# EAGLE design MarsLander (EAGLE 9.6.2)
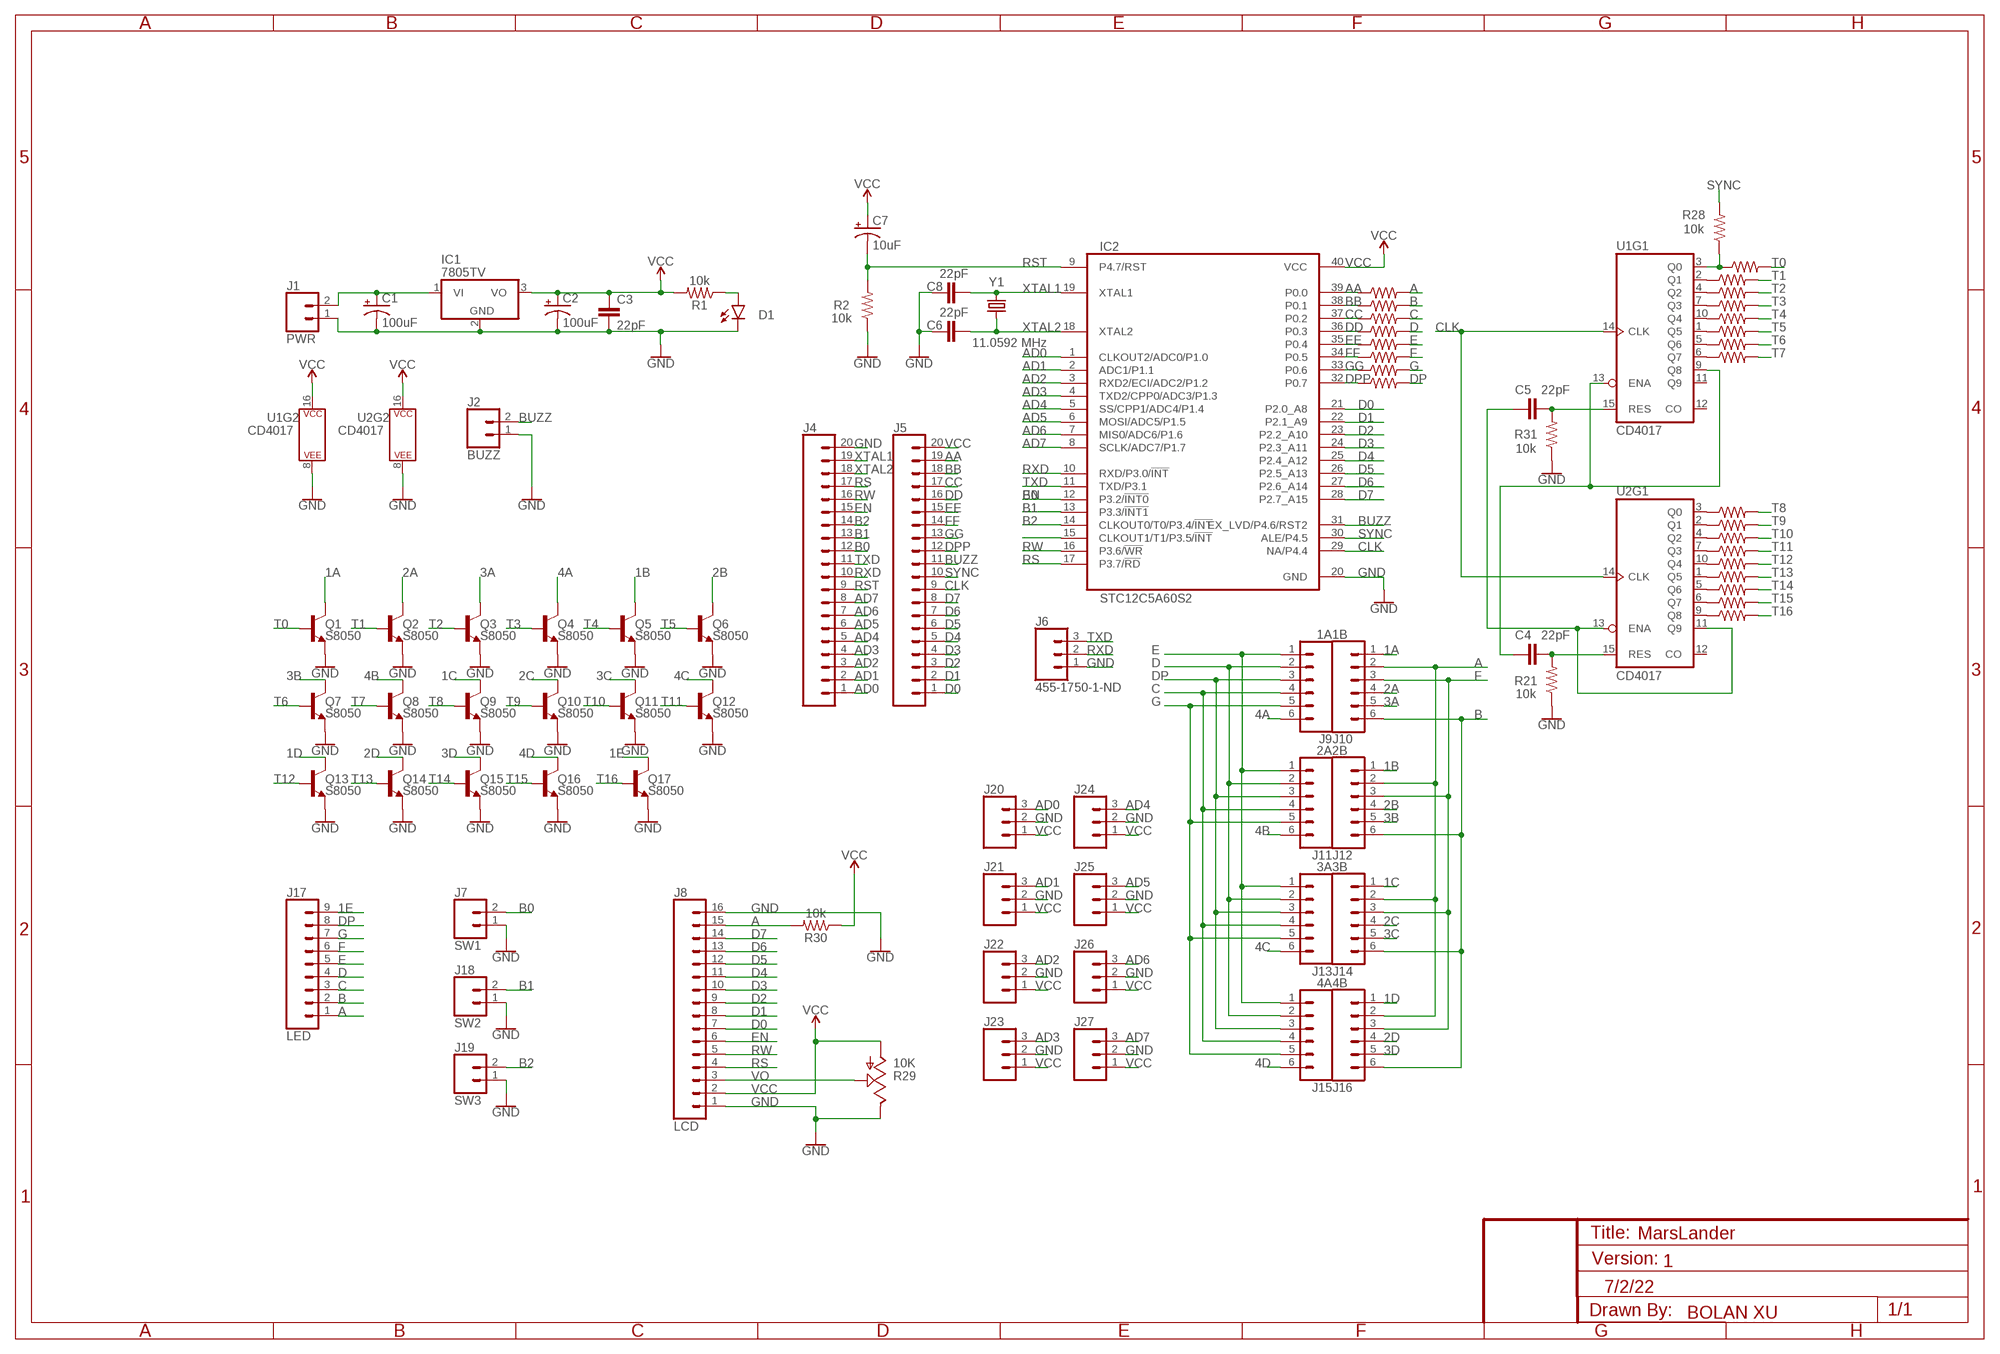
[diagram p0: schematic, sheet 1]

## Parts
C1  100uF  100UF-POLAR-RADIAL-2.5MM-25V-20%  [CPOL-RADIAL-2.5MM-6.5MM]
C2  100uF  100UF-POLAR-RADIAL-2.5MM-25V-20%  [CPOL-RADIAL-2.5MM-6.5MM]
C3  22pF  22PF-PTH-2.54MM-200V-5%  [CAP-PTH-2.54]
C4  22pF  22PF-PTH-2.54MM-200V-5%  [CAP-PTH-2.54]
C5  22pF  22PF-PTH-2.54MM-200V-5%  [CAP-PTH-2.54]
C6  22pF  22PF-PTH-2.54MM-200V-5%  [CAP-PTH-2.54]
C7  10uF  10UF-POLAR-RADIAL-2.5MM-25V-20%  [CPOL-RADIAL-2.5MM-5MM]
C8  22pF  22PF-PTH-2.54MM-200V-5%  [CAP-PTH-2.54]
D1  3MM  LED3MM  [LED_3MM]
IC1  7805TV  [TO220V]
IC2  STC12C5A60S2  STC125A60S2P  [DIL40]
J1  PWR  CONN_02  [1X02]
J2  BUZZ  CONN_02  [1X02]
J4  CONN_20  [1X20]
J5  CONN_20  [1X20]
J6  455-1750-1-ND  CONN_03  [1X03]
J7  SW1  CONN_02  [1X02]
J8  LCD  CONN_16  [1X16]
J9  1A  CONN_06SILK_FEMALE_PTH  [1X06]
J10  1B  CONN_06SILK_FEMALE_PTH  [1X06]
J11  2A  CONN_06SILK_FEMALE_PTH  [1X06]
J12  2B  CONN_06SILK_FEMALE_PTH  [1X06]
J13  3A  CONN_06SILK_FEMALE_PTH  [1X06]
J14  3B  CONN_06SILK_FEMALE_PTH  [1X06]
J15  4A  CONN_06SILK_FEMALE_PTH  [1X06]
J16  4B  CONN_06SILK_FEMALE_PTH  [1X06]
J17  LED  CONN_09  [1X09]
J18  SW2  CONN_02  [1X02]
J19  SW3  CONN_02  [1X02]
J20  455-1750-1-ND  CONN_03  [1X03]
J21  455-1750-1-ND  CONN_03  [1X03]
J22  455-1750-1-ND  CONN_03  [1X03]
J23  455-1750-1-ND  CONN_03  [1X03]
J24  455-1750-1-ND  CONN_03  [1X03]
J25  455-1750-1-ND  CONN_03  [1X03]
J26  455-1750-1-ND  CONN_03  [1X03]
J27  455-1750-1-ND  CONN_03  [1X03]
Q1  S8050  TRANS_NPN-2N3904  [TO-92]
Q2  S8050  TRANS_NPN-2N3904  [TO-92]
Q3  S8050  TRANS_NPN-2N3904  [TO-92]
Q4  S8050  TRANS_NPN-2N3904  [TO-92]
Q5  S8050  TRANS_NPN-2N3904  [TO-92]
Q6  S8050  TRANS_NPN-2N3904  [TO-92]
Q7  S8050  TRANS_NPN-2N3904  [TO-92]
Q8  S8050  TRANS_NPN-2N3904  [TO-92]
Q9  S8050  TRANS_NPN-2N3904  [TO-92]
Q10  S8050  TRANS_NPN-2N3904  [TO-92]
Q11  S8050  TRANS_NPN-2N3904  [TO-92]
Q12  S8050  TRANS_NPN-2N3904  [TO-92]
Q13  S8050  TRANS_NPN-2N3904  [TO-92]
Q14  S8050  TRANS_NPN-2N3904  [TO-92]
Q15  S8050  TRANS_NPN-2N3904  [TO-92]
Q16  S8050  TRANS_NPN-2N3904  [TO-92]
Q17  S8050  TRANS_NPN-2N3904  [TO-92]
R1  10k  10KOHM-HORIZ-1/4W-1%  [AXIAL-0.3]
R2  10k  10KOHM-HORIZ-1/4W-1%  [AXIAL-0.3]
R3  10k  10KOHM-HORIZ-1/4W-1%  [AXIAL-0.3]
R4  10k  10KOHM-HORIZ-1/4W-1%  [AXIAL-0.3]
R5  10k  10KOHM-HORIZ-1/4W-1%  [AXIAL-0.3]
R6  10k  10KOHM-HORIZ-1/4W-1%  [AXIAL-0.3]
R7  10k  10KOHM-HORIZ-1/4W-1%  [AXIAL-0.3]
R8  10k  10KOHM-HORIZ-1/4W-1%  [AXIAL-0.3]
R9  10k  10KOHM-HORIZ-1/4W-1%  [AXIAL-0.3]
R10  10k  10KOHM-HORIZ-1/4W-1%  [AXIAL-0.3]
R11  10k  10KOHM-HORIZ-1/4W-1%  [AXIAL-0.3]
R12  10k  10KOHM-HORIZ-1/4W-1%  [AXIAL-0.3]
R13  10k  10KOHM-HORIZ-1/4W-1%  [AXIAL-0.3]
R14  10k  10KOHM-HORIZ-1/4W-1%  [AXIAL-0.3]
R15  10k  10KOHM-HORIZ-1/4W-1%  [AXIAL-0.3]
R16  10k  10KOHM-HORIZ-1/4W-1%  [AXIAL-0.3]
R17  10k  10KOHM-HORIZ-1/4W-1%  [AXIAL-0.3]
R18  10k  10KOHM-HORIZ-1/4W-5%  [AXIAL-0.3]
R19  10k  10KOHM-HORIZ-1/4W-1%  [AXIAL-0.3]
R20  10k  10KOHM-HORIZ-1/4W-1%  [AXIAL-0.3]
R21  10k  10KOHM-HORIZ-1/4W-1%  [AXIAL-0.3]
R22  10k  10KOHM-HORIZ-1/4W-1%  [AXIAL-0.3]
R23  10k  10KOHM-HORIZ-1/4W-1%  [AXIAL-0.3]
R24  10k  10KOHM-HORIZ-1/4W-1%  [AXIAL-0.3]
R25  10k  10KOHM-HORIZ-1/4W-1%  [AXIAL-0.3]
R26  10k  10KOHM-HORIZ-1/4W-1%  [AXIAL-0.3]
R27  10k  10KOHM-HORIZ-1/4W-1%  [AXIAL-0.3]
R28  10k  10KOHM-HORIZ-1/4W-1%  [AXIAL-0.3]
R29  10K  TRIM_US-B25P  [B25P]
R30  10k  10KOHM-HORIZ-1/4W-1%  [AXIAL-0.3]
R31  10k  10KOHM-HORIZ-1/4W-1%  [AXIAL-0.3]
R33  10k  10KOHM-HORIZ-1/4W-1%  [AXIAL-0.3]
U1  CD4017  [DIP16]
U2  CD4017  [DIP16]
Y1  11.0592 MHz  CRYSTALPTH-HC49UV  [HC49U]

## Nets
1A: J10.1 Q1.3(C)
1B: J12.1 Q5.3(C)
1C: J14.1 Q9.3(C)
1D: J16.1 Q13.3(C)
1E: J17.9 Q17.3(C)
2A: J10.4 Q2.3(C)
2B: J12.4 Q6.3(C)
2C: J14.4 Q10.3(C)
2D: J16.4 Q14.3(C)
3A: J10.5 Q3.3(C)
3B: J12.5 Q7.3(C)
3C: J14.5 Q11.3(C)
3D: J16.5 Q15.3(C)
4A: J9.6 Q4.3(C)
4B: J11.6 Q8.3(C)
4C: J13.6 Q12.3(C)
4D: J15.6 Q16.3(C)
A: J8.15 J10.2 J12.2 J14.2 J16.2 J17.1 R19.P$2 R30.P$2
AA: IC2.39(P0.0) J5.19 R19.P$1
AD0: IC2.1(CLKOUT2/ADC0/P1.0) J4.1 J20.3
AD1: IC2.2(ADC1/P1.1) J4.2 J21.3
AD2: IC2.3(RXD2/ECI/ADC2/P1.2) J4.3 J22.3
AD3: IC2.4(TXD2/CPP0/ADC3/P1.3) J4.4 J23.3
AD4: IC2.5(SS/CPP1/ADC4/P1.4) J4.5 J24.3
AD5: IC2.6(MOSI/ADC5/P1.5) J4.6 J25.3
AD6: IC2.7(MIS0/ADC6/P1.6) J4.7 J26.3
AD7: IC2.8(SCLK/ADC7/P1.7) J4.8 J27.3
B: J10.6 J12.6 J14.6 J16.6 J17.2 R20.P$2
B0: IC2.12(P3.2/!INT0) J4.12 J7.2
B1: IC2.13(P3.3/!INT1) J4.13 J18.2
B2: IC2.14(CLKOUT0/T0/P3.4/!INT) J4.14 J19.2
BB: IC2.38(P0.1) J5.18 R20.P$1
BUZZ: IC2.31(EX_LVD/P4.6/RST2) J2.2 J5.11
C: J9.4 J11.4 J13.4 J15.4 J17.3 R22.P$2
CC: IC2.37(P0.2) J5.17 R22.P$1
CLK: IC2.29(NA/P4.4) J5.9 U1.14(CLK) U2.14(CLK)
D: J9.2 J11.2 J13.2 J15.2 J17.4 R23.P$2
D0: IC2.21(P2.0_A8) J5.1 J8.7
D1: IC2.22(P2.1_A9) J5.2 J8.8
D2: IC2.23(P2.2_A10) J5.3 J8.9
D3: IC2.24(P2.3_A11) J5.4 J8.10
D4: IC2.25(P2.4_A12) J5.5 J8.11
D5: IC2.26(P2.5_A13) J5.6 J8.12
D6: IC2.27(P2.6_A14) J5.7 J8.13
D7: IC2.28(P2.7_A15) J5.8 J8.14
DD: IC2.36(P0.3) J5.16 R23.P$1
DP: J9.3 J11.3 J13.3 J15.3 J17.8 R27.P$2
DPP: IC2.32(P0.7) J5.12 R27.P$1
E: J9.1 J11.1 J13.1 J15.1 J17.5 R24.P$2
EE: IC2.35(P0.4) J5.15 R24.P$1
EN: IC2.15(CLKOUT1/T1/P3.5/!INT) J4.15 J8.6
F: J10.3 J12.3 J14.3 J16.3 J17.6 R25.P$2
FF: IC2.34(P0.5) J5.14 R25.P$1
G: J9.5 J11.5 J13.5 J15.5 J17.7 R26.P$2
GG: IC2.33(P0.6) J5.13 R26.P$1
GND [supply]: C1.2(-) C2.2(-) C3.2 C6.1 C8.1 D1.K(C) IC1.2(GND) IC2.20(GND) J1.1 J2.1 J4.20 J6.1 J7.1 J8.1 J8.16 J18.1 J19.1 J20.2 J21.2 J22.2 J23.2 J24.2 J25.2 J26.2 J27.2 Q1.1(E) Q2.1(E) Q3.1(E) Q4.1(E) Q5.1(E) Q6.1(E) Q7.1(E) Q8.1(E) Q9.1(E) Q10.1(E) Q11.1(E) Q12.1(E) Q13.1(E) Q14.1(E) Q15.1(E) Q16.1(E) Q17.1(E) R2.P$1 R21.P$1 R29.E R31.P$1 U1.8(P$V-) U2.8(P$V-)
N$2: C1.1(+) IC1.1(VI) J1.2
N$3: C4.1 U1.9(Q8) U1.13(ENA)
N$4: C5.1 U2.11(Q9) U2.13(ENA)
N$5: C5.2 R31.P$2 U1.15(RES)
N$6: C4.2 R21.P$2 U2.15(RES)
N$12: R28.P$1 R33.P$1 U1.3(Q0)
N$13: R3.P$1 U1.2(Q1)
N$14: R4.P$1 U1.4(Q2)
N$15: R5.P$1 U1.7(Q3)
N$16: R6.P$1 U1.10(Q4)
N$17: R7.P$1 U1.1(Q5)
N$18: R8.P$1 U1.5(Q6)
N$19: R9.P$1 U1.6(Q7)
N$20: R10.P$1 U2.3(Q0)
N$21: R11.P$1 U2.2(Q1)
N$22: R12.P$1 U2.4(Q2)
N$23: D1.A R1.P$1
N$24: R13.P$1 U2.7(Q3)
N$25: R14.P$1 U2.10(Q4)
N$26: R15.P$1 U2.1(Q5)
N$27: R16.P$1 U2.5(Q6)
N$28: R17.P$1 U2.6(Q7)
N$29: R18.P$1 U2.9(Q8)
RS: IC2.17(P3.7/!RD) J4.17 J8.4
RST: C7.2(-) IC2.9(P4.7/RST) J4.9 R2.P$2
RW: IC2.16(P3.6/!WR) J4.16 J8.5
RXD: IC2.10(RXD/P3.0/!INT) J4.10 J6.2
SYNC: IC2.30(ALE/P4.5) J5.10 R28.P$2
T0: Q1.2(B) R33.P$2
T1: Q2.2(B) R3.P$2
T2: Q3.2(B) R4.P$2
T3: Q4.2(B) R5.P$2
T4: Q5.2(B) R6.P$2
T5: Q6.2(B) R7.P$2
T6: Q7.2(B) R8.P$2
T7: Q8.2(B) R9.P$2
T8: Q9.2(B) R10.P$2
T9: Q10.2(B) R11.P$2
T10: Q11.2(B) R12.P$2
T11: Q12.2(B) R13.P$2
T12: Q13.2(B) R14.P$2
T13: Q14.2(B) R15.P$2
T14: Q15.2(B) R16.P$2
T15: Q16.2(B) R17.P$2
T16: Q17.2(B) R18.P$2
TXD: IC2.11(TXD/P3.1) J4.11 J6.3
VCC [supply]: C2.1(+) C3.1 C7.1(+) IC1.3(VO) IC2.40(VCC) J5.20 J8.2 J20.1 J21.1 J22.1 J23.1 J24.1 J25.1 J26.1 J27.1 R1.P$2 R29.A R30.P$1 U1.16(P$V+) U2.16(P$V+)
VO: J8.3 R29.S
XTAL1: C8.2 IC2.19(XTAL1) J4.19 Y1.2
XTAL2: C6.2 IC2.18(XTAL2) J4.18 Y1.1
Unconnected: U1.11(Q9) U1.12(CO) U2.12(CO)

## Notes on the sheet
- 1
- 7/2/22
- BOLAN XU

## Library data of the parts
C1 C2 = SparkFun-Capacitors:100UF-POLAR: 100µF polarized capacitors A capacitor is a passive two-terminal electrical component used to store electrical energy temporarily in an electric field.; PROD_ID: CAP-08439
C3-C6 C8 = SparkFun-Capacitors:22PF: 22pF ceramic capacitors A capacitor is a passive two-terminal electrical component used to store electrical energy temporarily in an electric field.; PROD_ID: CAP-09128
C7 = SparkFun-Capacitors:10UF-POLAR: 10.0µF polarized capacitors A capacitor is a passive two-terminal electrical component used to store electrical energy temporarily in an electric field.; PROD_ID: CAP-08440
D1 = SparkFun-LED:LED: LED (Generic) Standard schematic elements and footprints for 5mm, 3mm, 1206, and 0603 sized LEDs. Generic LEDs with no color specified.; PROD_ID: DIO-08794
IC1 = linear:78*: Positive VOLTAGE REGULATOR Source: http://cache.national.com/ds/LM/LM78L05.pdf http://www.fairchildsemi.com/ds/LM/LM7805.pdf
IC2 = stc-microcontrollers:STC125A60S2: 8-bit Microcontroller with 4K BytesIn-System Programmable Flash Source: http://www.atmel.com/dyn/resources/prod_documents/doc2487.pdf
J1 J2 J7 J18 J19 = SparkFun-Connectors:CONN_02: Multi connection point. Often used as Generic Header-pin footprint for 0.1 inch spaced/style header connections On any of the 0.1 inch spaced packages, you can populate with these: Break Away Headers - Straight <https://www.sparkfun.com/products/116> (PRT-00116) Break Away Male Headers - Right Angle <https://www.sparkfun.com/products/553> (PRT-00553) Female Headers <https://www.sparkfun.com/products/115> (PRT-00115) Break Away Headers - Machine Pin <https://www.sparkfun.com/products/117> (PRT-00117) Break Away Female Headers - Swiss Machine Pin <https://www.sparkfun.com/products/743> (PRT-00743) For SCREWTERMINALS and SPRING TERMINALS visit here: Screw Terimnals on SparkFun.com <https://www.sparkfun.com/search/results?term=Screw+Terminals> (5mm/3.5mm/2.54mm spacing) This device is also useful as a general connection point to wire up your design to another part of your project. Our various solder wires solder well into these plated through hole pads. Hook-Up Wire - Assortment (Stranded, 22 AWG) <https://www.sparkfun.com/products/11375> (PRT-11375) Hook-Up Wire - Assortment (Solid Core, 22 AWG) <https://www.sparkfun.com/products/11367> (PRT-11367) View the entire wire category on our website here <https://www.sparkfun.com/categories/141> Special notes: Molex polarized connector foot print use with: PRT-08233 with associated crimp pins and housings. 2.54_SCREWTERM for use with PRT-10571. 3.5mm Screw Terminal footprints for PRT-08084 5mm Screw Terminal footprints for use with PRT-08432
J4 J5 = SparkFun-Connectors:CONN_20: Multi connection point. Often used as Generic Header-pin footprint for 0.1 inch spaced/style header connections On any of the 0.1 inch spaced packages, you can populate with these: Break Away Headers - Straight <https://www.sparkfun.com/products/116> (PRT-00116) Break Away Male Headers - Right Angle <https://www.sparkfun.com/products/553> (PRT-00553) Female Headers <https://www.sparkfun.com/products/115> (PRT-00115) Break Away Headers - Machine Pin <https://www.sparkfun.com/products/117> (PRT-00117) Break Away Female Headers - Swiss Machine Pin <https://www.sparkfun.com/products/743> (PRT-00743) For SCREWTERMINALS and SPRING TERMINALS visit here: Screw Terimnals on SparkFun.com <https://www.sparkfun.com/search/results?term=Screw+Terminals> (5mm/3.5mm/2.54mm spacing) This device is also useful as a general connection point to wire up your design to another part of your project. Our various solder wires solder well into these plated through hole pads. Hook-Up Wire - Assortment (Stranded, 22 AWG) <https://www.sparkfun.com/products/11375> (PRT-11375) Hook-Up Wire - Assortment (Solid Core, 22 AWG) <https://www.sparkfun.com/products/11367> (PRT-11367) View the entire wire category on our website here <https://www.sparkfun.com/categories/141> Special notes: Molex polarized connector foot print use with SKU : PRT-08231 with associated crimp pins and housings. 1MM SMD Version SKU: PRT-10208 NOTES ON THE VARIANTS LOCK and LOCK_LONGPADS... This footprint was designed to help hold the alignment of a through-hole component (i.e. 6-pin header) while soldering it into place. You may notice that each hole has been shifted either up or down by 0.005 of an inch from it's more standard position (which is a perfectly straight line). This slight alteration caused the pins (the squares in the middle) to touch the edges of the holes. Because they are alternating, it causes a "brace" to hold the component in place. 0.005 has proven to be the perfect amount of "off-center" position when using our standard breakaway headers. Although looks a little odd when you look at the bare footprint, once you have a header in there, the alteration is very hard to notice. Also,if you push a header all the way into place, it is covered up entirely on the bottom side. Note about LOCK SPECIAL package: This is just like the LOCK variant in that the holes are staggared by 5 mil, but except for the last two holes. They are not altered from the "standard" footprint layout. This is used for a special purpose on the layout of our Graphic LCD Backpack. Make sure you want to use this device before selecting it for you project!
J6 J20-J27 = SparkFun-Connectors:CONN_03: Multi connection point. Often used as Generic Header-pin footprint for 0.1 inch spaced/style header connections On any of the 0.1 inch spaced packages, you can populate with these: Break Away Headers - Straight <https://www.sparkfun.com/products/116> (PRT-00116) Break Away Male Headers - Right Angle <https://www.sparkfun.com/products/553> (PRT-00553) Female Headers <https://www.sparkfun.com/products/115> (PRT-00115) Break Away Headers - Machine Pin <https://www.sparkfun.com/products/117> (PRT-00117) Break Away Female Headers - Swiss Machine Pin <https://www.sparkfun.com/products/743> (PRT-00743) Stackable Header - 3 Pin (Female, 0.1") <https://www.sparkfun.com/products/13875> (PRT-13875) For SCREWTERMINALS and SPRING TERMINALS visit here: Screw Terimnals on SparkFun.com <https://www.sparkfun.com/search/results?term=Screw+Terminals> (5mm/3.5mm/2.54mm spacing) This device is also useful as a general connection point to wire up your design to another part of your project. Our various solder wires solder well into these plated through hole pads. Hook-Up Wire - Assortment (Stranded, 22 AWG) <https://www.sparkfun.com/products/11375> (PRT-11375) Hook-Up Wire - Assortment (Solid Core, 22 AWG) <https://www.sparkfun.com/products/11367> (PRT-11367) View the entire wire category on our website here <https://www.sparkfun.com/categories/141> Special notes: Molex polarized connector foot print use with SKU : PRT-08232 with associated crimp pins and housings.; PROD_ID: XXX-00000
J8 = SparkFun-Connectors:CONN_16: Multi connection point. Often used as Generic Header-pin footprint for 0.1 inch spaced/style header connections On any of the 0.1 inch spaced packages, you can populate with these: Break Away Headers - Straight <https://www.sparkfun.com/products/116> (PRT-00116) Break Away Male Headers - Right Angle <https://www.sparkfun.com/products/553> (PRT-00553) Female Headers <https://www.sparkfun.com/products/115> (PRT-00115) Break Away Headers - Machine Pin <https://www.sparkfun.com/products/117> (PRT-00117) Break Away Female Headers - Swiss Machine Pin <https://www.sparkfun.com/products/743> (PRT-00743) For SCREWTERMINALS and SPRING TERMINALS visit here: Screw Terimnals on SparkFun.com <https://www.sparkfun.com/search/results?term=Screw+Terminals> (5mm/3.5mm/2.54mm spacing) This device is also useful as a general connection point to wire up your design to another part of your project. Our various solder wires solder well into these plated through hole pads. Hook-Up Wire - Assortment (Stranded, 22 AWG) <https://www.sparkfun.com/products/11375> (PRT-11375) Hook-Up Wire - Assortment (Solid Core, 22 AWG) <https://www.sparkfun.com/products/11367> (PRT-11367) View the entire wire category on our website here <https://www.sparkfun.com/categories/141> Special notes: Molex polarized connector foot print use with SKU : PRT-08231 with associated crimp pins and housings. 1MM SMD Version SKU: PRT-10208 NOTES ON THE VARIANTS LOCK and LOCK_LONGPADS... This footprint was designed to help hold the alignment of a through-hole component (i.e. 6-pin header) while soldering it into place. You may notice that each hole has been shifted either up or down by 0.005 of an inch from it's more standard position (which is a perfectly straight line). This slight alteration caused the pins (the squares in the middle) to touch the edges of the holes. Because they are alternating, it causes a "brace" to hold the component in place. 0.005 has proven to be the perfect amount of "off-center" position when using our standard breakaway headers. Although looks a little odd when you look at the bare footprint, once you have a header in there, the alteration is very hard to notice. Also,if you push a header all the way into place, it is covered up entirely on the bottom side.
J9-J16 = SparkFun-Connectors:CONN_06: Multi connection point. Often used as Generic Header-pin footprint for 0.1 inch spaced/style header connections On any of the 0.1 inch spaced packages, you can populate with these: Break Away Headers - Straight <https://www.sparkfun.com/products/116> (PRT-00116) Break Away Male Headers - Right Angle <https://www.sparkfun.com/products/553> (PRT-00553) Female Headers <https://www.sparkfun.com/products/115> (PRT-00115) Break Away Headers - Machine Pin <https://www.sparkfun.com/products/117> (PRT-00117) Break Away Female Headers - Swiss Machine Pin <https://www.sparkfun.com/products/743> (PRT-00743) Arduino Stackable Header - 6 Pin <https://www.sparkfun.com/products/9280> (PRT-09280) Screw Terminals 2.54mm Pitch (6-Pin) <https://www.sparkfun.com/products/16499> (PRT-16499) For SCREWTERMINALS and SPRING TERMINALS visit here: Screw Terimnals on SparkFun.com <https://www.sparkfun.com/search/results?term=Screw+Terminals> (5mm/3.5mm/2.54mm spacing) This device is also useful as a general connection point to wire up your design to another part of your project. Our various solder wires solder well into these plated through hole pads. Hook-Up Wire - Assortment (Stranded, 22 AWG) <https://www.sparkfun.com/products/11375> (PRT-11375) Hook-Up Wire - Assortment (Solid Core, 22 AWG) <https://www.sparkfun.com/products/11367> (PRT-11367) View the entire wire category on our website here <https://www.sparkfun.com/categories/141>; PROD_ID: CONN-08437
J17 = SparkFun-Connectors:CONN_09: Multi connection point. Often used as Generic Header-pin footprint for 0.1 inch spaced/style header connections On any of the 0.1 inch spaced packages, you can populate with these: Break Away Headers - Straight <https://www.sparkfun.com/products/116> (PRT-00116) Break Away Male Headers - Right Angle <https://www.sparkfun.com/products/553> (PRT-00553) Female Headers <https://www.sparkfun.com/products/115> (PRT-00115) Break Away Headers - Machine Pin <https://www.sparkfun.com/products/117> (PRT-00117) Break Away Female Headers - Swiss Machine Pin <https://www.sparkfun.com/products/743> (PRT-00743) For SCREWTERMINALS and SPRING TERMINALS visit here: Screw Terimnals on SparkFun.com <https://www.sparkfun.com/search/results?term=Screw+Terminals> (5mm/3.5mm/2.54mm spacing) This device is also useful as a general connection point to wire up your design to another part of your project. Our various solder wires solder well into these plated through hole pads. Hook-Up Wire - Assortment (Stranded, 22 AWG) <https://www.sparkfun.com/products/11375> (PRT-11375) Hook-Up Wire - Assortment (Solid Core, 22 AWG) <https://www.sparkfun.com/products/11367> (PRT-11367) View the entire wire category on our website here <https://www.sparkfun.com/categories/141> Special notes: Molex polarized connector foot print use with SKU : PRT-08231 with associated crimp pins and housings. 1MM SMD Version SKU: PRT-10208 NOTES ON THE VARIANTS LOCK and LOCK_LONGPADS... This footprint was designed to help hold the alignment of a through-hole component (i.e. 6-pin header) while soldering it into place. You may notice that each hole has been shifted either up or down by 0.005 of an inch from it's more standard position (which is a perfectly straight line). This slight alteration caused the pins (the squares in the middle) to touch the edges of the holes. Because they are alternating, it causes a "brace" to hold the component in place. 0.005 has proven to be the perfect amount of "off-center" position when using our standard breakaway headers. Although looks a little odd when you look at the bare footprint, once you have a header in there, the alteration is very hard to notice. Also,if you push a header all the way into place, it is covered up entirely on the bottom side.
Q1-Q17 = SparkFun-DiscreteSemi:TRANS_NPN: NPN transistor Current controlled devices typically used to amplify current or used as a switch. BC547 - COM-08928 <http://www.sparkfun.com/products/8928> (TO-92 45V 100mA) (1.Collector 2.Base 3.Emitter) 2N3904 - COM-00521 <http://www.sparkfun.com/products/521> (TO-92 40V 200mA) (1.Emitter 2.Base 3.Collector) P2N2222A - COM-12852 <http://www.sparkfun.com/products/12852> (TO-92 40V 600mA) (1.Collector 2.Base 3.Emitter); PROD_ID: TRANS-08447; VALUE: 200mA/40V
R1-R17 R19-R28 R30 R31 R33 = SparkFun-Resistors:10KOHM: 10kΩ resistor A resistor is a passive two-terminal electrical component that implements electrical resistance as a circuit element. Resistors act to reduce current flow, and, at the same time, act to lower voltage levels within circuits. - Wikipedia; PROD_ID: RES-12183
R18 = SparkFun-Resistors:10KOHM: 10kΩ resistor A resistor is a passive two-terminal electrical component that implements electrical resistance as a circuit element. Resistors act to reduce current flow, and, at the same time, act to lower voltage levels within circuits. - Wikipedia; PROD_ID: RES-09435
R29 = pot:TRIM_US-: POTENTIOMETER
U1 U2 = SparkFun-IC-Logic:CD4017: 10-Out Decade Counter Datasheet <https://cdn.sparkfun.com/datasheets/Kits/cd4022b.pdf> SparkFun Products SparkFun SparkPunk Sequencer Kit <https://www.sparkfun.com/products/12707> (KIT-12707); PROD_ID: IC-11929
Y1 = SparkFun-Clocks:CRYSTAL: Crystals (Generic) These are passive quartz crystals, which can be used as a clock source for a microcontroller. Crystal's are two-terminal devices. They require external "load" capacitors to generate an oscillating signal.

## Net classes
1 supply: width 0.508 mm

## Board
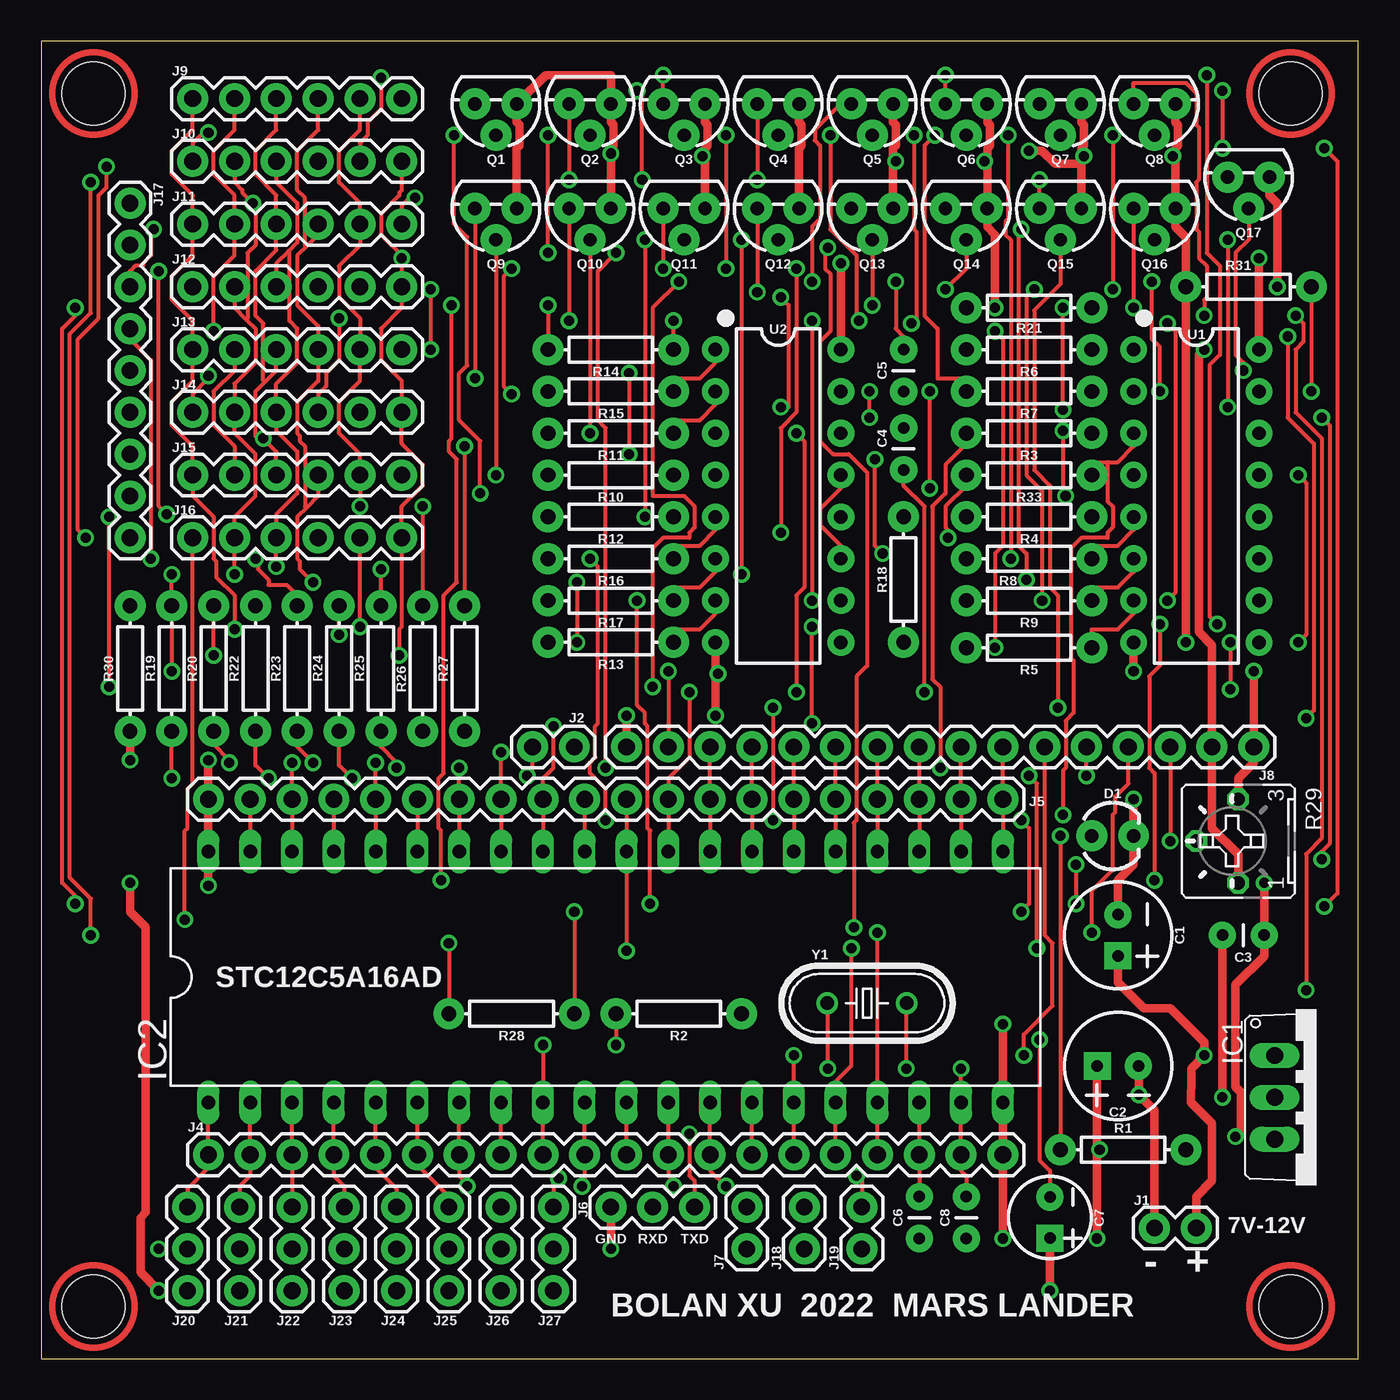
[diagram p1: board, top side]
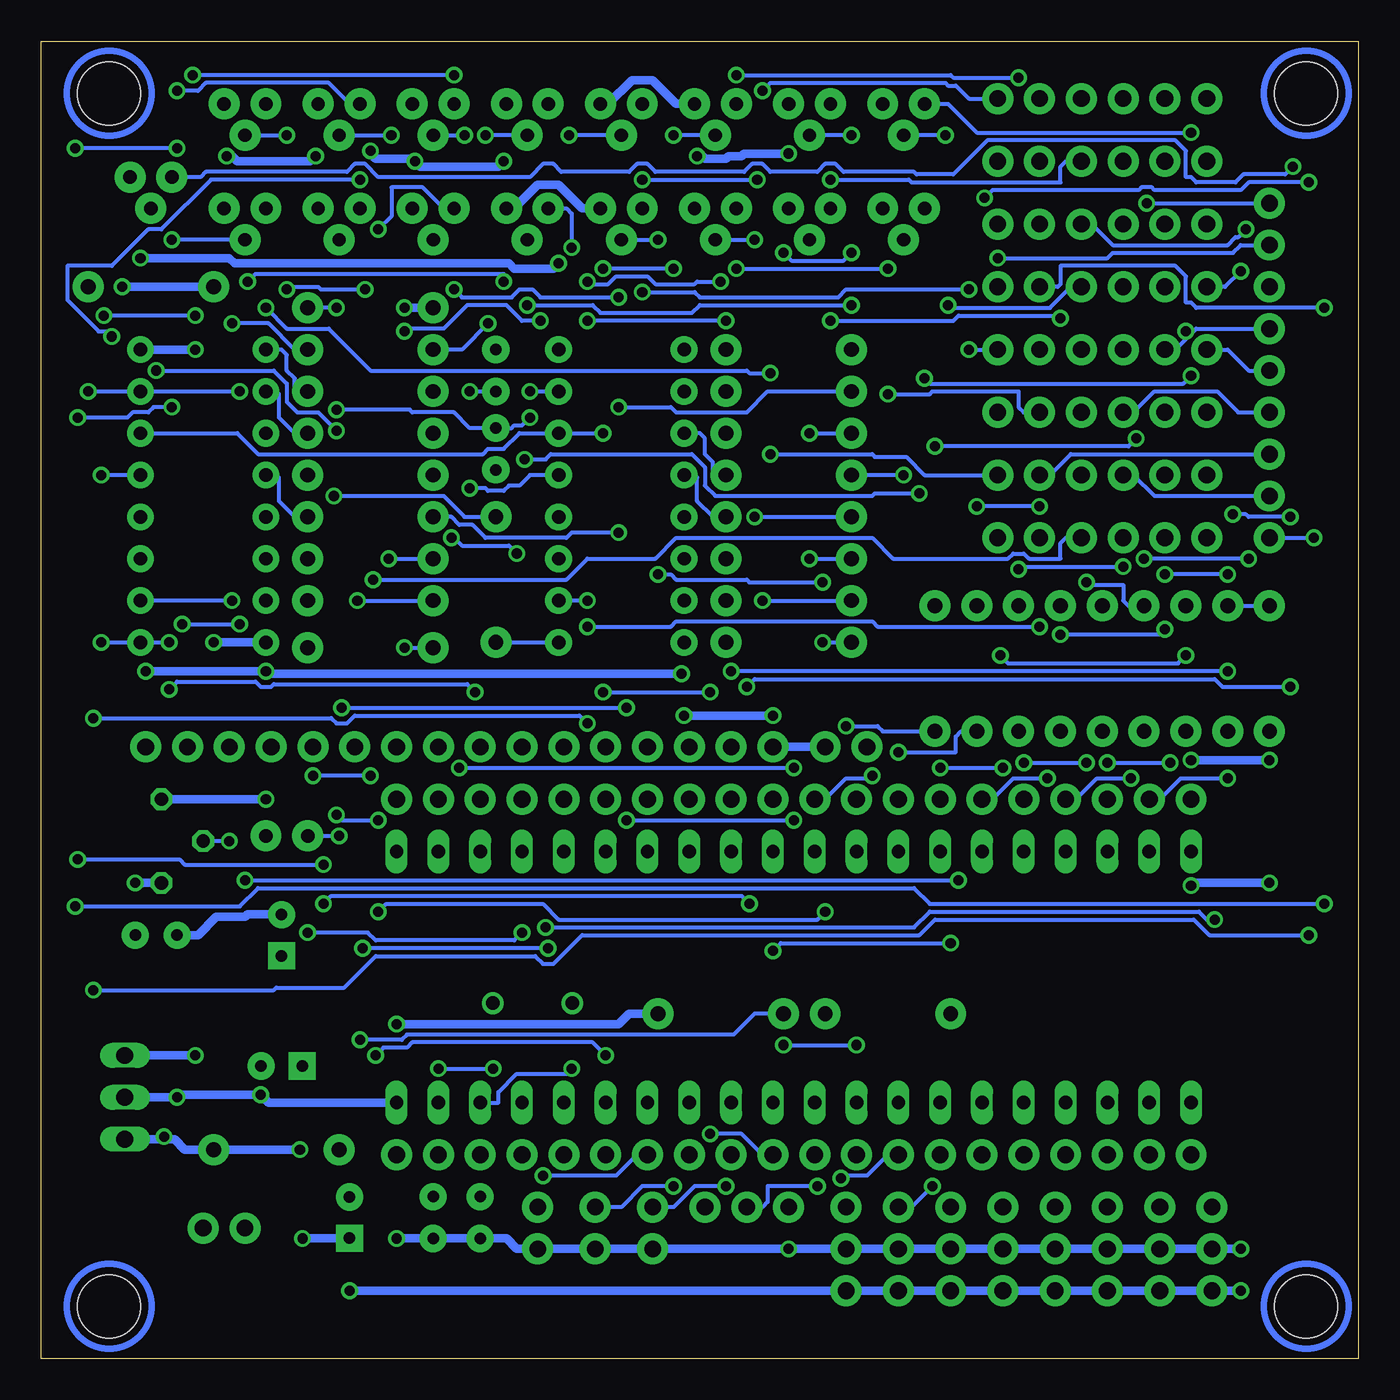
[diagram p2: board, bottom side, seen from below]

Size 80.01 x 80 mm. Coordinates in mm from the lower left corner, seen from the top.
Outline: 0,80 0,0 80.01,0.01 80.01,80 0,80
Copper layers (1*16): Top 0.035mm / dielectric 1.5mm / Bottom 0.035mm
Design rules "default": minimum track width 10mil, minimum drill 24mil, track to track 8mil, track to pad 8mil, pad to pad 8mil, via to via 8mil, smd to smd 8mil, copper to edge 40mil, drill to drill 8mil, minimum pad ring 10mil, minimum via ring 8mil, stop-mask expansion 4mil, vias tented up to drill 0mil, thermal gap 10mil
Holes 3.81 mm at 3.17,76.83 3.17,3.17 75.88,76.83 75.88,3.17

### Footprints (pad centres in the part's own frame; a part is rotated, then mirrored left to right if it is on the bottom)
CPOL-RADIAL-2.5MM-6.5MM = drill 0.7 pad 1.651 square: 1 1.25,0 | drill 0.7 pad 1.651: 2 -1.25,0
CAP-PTH-2.54 = drill 0.7 pad 1.651: 1 -1.27,0; 2 1.27,0
CPOL-RADIAL-2.5MM-5MM = drill 0.7 pad 1.651 square: 1 1.25,0 | drill 0.7 pad 1.651: 2 -1.25,0
LED_3MM = drill 0.813 pad 1.88: A -1.27,0; K 1.27,0
TO220V = drill 1.016 long: 1 -2.54,-2.54; 2 0,-2.54; 3 2.54,-2.54
DIL40 = drill 0.813 long: 1 -24.13,-7.62; 2 -21.59,-7.62; 3 -19.05,-7.62; 4 -16.51,-7.62; 5 -13.97,-7.62; 6 -11.43,-7.62; 7 -8.89,-7.62; 8 -6.35,-7.62; 9 -3.81,-7.62; 10 -1.27,-7.62; 11 1.27,-7.62; 12 3.81,-7.62; 13 6.35,-7.62; 14 8.89,-7.62; 15 11.43,-7.62; 16 13.97,-7.62; 17 16.51,-7.62; 18 19.05,-7.62; 19 21.59,-7.62; 20 24.13,-7.62; 21 24.13,7.62; 22 21.59,7.62; 23 19.05,7.62; 24 16.51,7.62; 25 13.97,7.62; 26 11.43,7.62; 27 8.89,7.62; 28 6.35,7.62; 29 3.81,7.62; 30 1.27,7.62; 31 -1.27,7.62; 32 -3.81,7.62; 33 -6.35,7.62; 34 -8.89,7.62; 35 -11.43,7.62; 36 -13.97,7.62; 37 -16.51,7.62; 38 -19.05,7.62; 39 -21.59,7.62; 40 -24.13,7.62
1X02 = drill 1.016 pad 1.88: 1 0,0; 2 2.54,0
1X20 = drill 1.016 pad 1.88: 1 0,0; 2 2.54,0; 3 5.08,0; 4 7.62,0; 5 10.16,0; 6 12.7,0; 7 15.24,0; 8 17.78,0; 9 20.32,0; 10 22.86,0; 11 25.4,0; 12 27.94,0; 13 30.48,0; 14 33.02,0; 15 35.56,0; 16 38.1,0; 17 40.64,0; 18 43.18,0; 19 45.72,0; 20 48.26,0
1X03 = drill 1.016 pad 1.88: 1 0,0; 2 2.54,0; 3 5.08,0
1X16 = drill 1.016 pad 1.88: 1 0,0; 2 2.54,0; 3 5.08,0; 4 7.62,0; 5 10.16,0; 6 12.7,0; 7 15.24,0; 8 17.78,0; 9 20.32,0; 10 22.86,0; 11 25.4,0; 12 27.94,0; 13 30.48,0; 14 33.02,0; 15 35.56,0; 16 38.1,0
1X06 = drill 1.016 pad 1.88: 1 0,0; 2 2.54,0; 3 5.08,0; 4 7.62,0; 5 10.16,0; 6 12.7,0
1X09 = drill 1.016 pad 1.88: 1 0,0; 2 2.54,0; 3 5.08,0; 4 7.62,0; 5 10.16,0; 6 12.7,0; 7 15.24,0; 8 17.78,0; 9 20.32,0
TO-92 = drill 0.813 pad 1.88: 1 -1.27,0; 2 0,1.905; 3 1.27,0
AXIAL-0.3 = drill 0.9 pad 1.88: P$1 -3.81,0; P$2 3.81,0
B25P = drill 0.813 octagon: A -2.54,0; E 2.54,0; S 0,2.54
DIP16 = drill 0.813 pad 1.626: 1 -8.89,-3.81; 2 -6.35,-3.81; 3 -3.81,-3.81; 4 -1.27,-3.81; 5 1.27,-3.81; 6 3.81,-3.81; 7 6.35,-3.81; 8 8.89,-3.81; 9 8.89,3.81; 10 6.35,3.81; 11 3.81,3.81; 12 1.27,3.81; 13 -1.27,3.81; 14 -3.81,3.81; 15 -6.35,3.81; 16 -8.89,3.81
HC49U = drill 0.813: 1 -2.413,0; 2 2.413,0

### Placement (x,y rotation side)
C1  65.41,25.72 270 top
C2  65.41,17.78 180 top
C3  73.03,25.72 180 top
C4  52.39,55.24 90 top
C5  52.39,60.01 90 top
C6  53.34,8.57 90 top
C7  61.28,8.57 270 top
C8  56.2,8.57 90 top
D1  65.09,31.75 0 top
IC1  77.47,15.88 270 top
IC2  34.29,23.18 0 top
J1  67.63,7.94 0 top
J2  32.38,37.15 180 top
J4  10.16,12.38 0 top
J5  58.42,33.97 180 top
J6  34.61,9.21 0 top
J7  42.86,6.67 90 top
J8  73.66,37.15 180 top
J9  9.21,76.52 0 top
J10  9.21,72.71 0 top
J11  9.21,68.9 0 top
J12  9.21,65.09 0 top
J13  9.21,61.28 0 top
J14  9.21,57.47 0 top
J15  9.21,53.66 0 top
J16  9.21,49.85 0 top
J17  5.4,70.17 270 top
J18  46.35,6.67 90 top
J19  49.85,6.67 90 top
J20  8.89,4.13 90 top
J21  12.06,4.13 90 top
J22  15.24,4.13 90 top
J23  18.41,4.13 90 top
J24  21.59,4.13 90 top
J25  24.77,4.13 90 top
J26  27.94,4.13 90 top
J27  31.11,4.13 90 top
Q1  27.62,76.2 180 top
Q2  33.34,76.2 180 top
Q3  39.05,76.2 180 top
Q4  44.77,76.2 180 top
Q5  50.48,76.2 180 top
Q6  56.2,76.2 180 top
Q7  61.91,76.2 180 top
Q8  67.63,76.2 180 top
Q9  27.62,69.85 180 top
Q10  33.34,69.85 180 top
Q11  39.05,69.85 180 top
Q12  44.77,69.85 180 top
Q13  50.48,69.85 180 top
Q14  56.2,69.85 180 top
Q15  61.91,69.85 180 top
Q16  67.63,69.85 180 top
Q17  73.34,71.75 180 top
R1  65.72,12.7 0 top
R2  38.73,20.95 180 top
R3  60.01,56.2 180 top
R4  60.01,51.12 180 top
R5  60.01,43.18 180 top
R6  60.01,61.28 180 top
R7  60.01,58.74 180 top
R8  60.01,48.58 180 top
R9  60.01,46.04 180 top
R10  34.61,53.66 180 top
R11  34.61,56.2 180 top
R12  34.61,51.12 180 top
R13  34.61,43.5 180 top
R14  34.61,61.28 180 top
R15  34.61,58.74 180 top
R16  34.61,48.58 180 top
R17  34.61,46.04 180 top
R18  52.39,47.31 90 top
R19  7.94,41.91 90 top
R20  10.48,41.91 90 top
R21  60.01,63.82 0 top
R22  13.02,41.91 90 top
R23  15.56,41.91 90 top
R24  18.1,41.91 90 top
R25  20.64,41.91 90 top
R26  23.18,41.91 90 top
R27  25.72,41.91 90 top
R28  28.57,20.95 180 top
R29  72.71,31.43 90 top
R30  5.4,41.91 90 top
R31  73.34,65.09 0 top
R33  60.01,53.66 180 top
U1  70.17,52.39 270 top
U2  44.77,52.39 270 top
Y1  50.16,21.59 0 top

### Tracks (layer width: path | path; a pad name or v marks a point on that pad's centre or on a via)
1A  (via drill 0.61)
  Top 0.254: J10.1 9.21,73.82 9.84,74.45 v10.16,74.45
  Bottom 0.254: v10.16,74.45 23.18,74.45 24.92,76.2 Q1.3
1B  (via drill 0.61)
  Top 0.254: v7.14,66.04 7.14,51.75 v7.62,51.28 | v4.13,40.8 v4.13,51.12 | v37.15,40.8 37.15,49.21 37.78,49.85 39.37,49.85 39.37,50.16 39.69,50.48 39.69,51.75 39.05,52.39 37.15,52.39 37.15,63.82 v38.73,65.41 | v46.83,65.41 46.83,68.74 47.31,69.22 47.31,73.66 46.99,73.98 46.99,74.61 48.42,76.04 49.21,76.04 Q5.3
  Bottom 0.254: J12.1 8.1,65.09 v7.14,66.04 | v7.62,51.28 6.83,51.28 6.67,51.12 v4.13,51.12 | v4.13,40.8 8.26,40.8 8.73,41.27 36.67,41.27 v37.15,40.8 | v38.73,65.41 40.16,65.41 40.32,65.25 42.7,65.25 43.18,65.72 45.09,65.72 45.56,65.25 46.67,65.25 v46.83,65.41
1C  (via drill 0.61)
  Top 0.254: J14.1 9.21,58.58 10.16,59.53 v10.16,59.69 | Q9.3 v26.35,59.53
  Bottom 0.254: v10.16,59.69 10.64,59.21 26.04,59.21 v26.35,59.53
1D  (via drill 0.61)
  Top 0.254: J16.1 9.21,34.92 8.89,34.61 8.89,32.23 8.73,32.07 v8.73,26.67 | v49.37,26.19 49.37,32.54 49.53,32.7 49.53,41.43 50.16,42.07 50.16,53.82 49.05,54.93 48.1,54.93 47.31,55.72 47.31,61.75 47.94,62.39 47.94,65.88 47.62,66.2 47.62,67.31 v47.78,67.47
  Bottom 0.254: v8.73,26.67 9.21,26.67 9.68,27.15 26.04,27.15 26.99,26.19 v49.37,26.19 | v47.78,67.47 47.78,69.53 48.1,69.85 Q13.3
1E  (via drill 0.61)
  Top 0.254: v3.97,72.39 3.97,71.12 3.49,70.64 3.49,63.18 2.22,61.91 2.22,50.32 v2.7,49.85
  Bottom 0.254: Q17.3 70.33,71.75 70.01,72.07 61.44,72.07 60.96,72.55 60.33,72.55 59.53,71.75 50.32,71.75 49.53,72.55 48.9,72.55 48.42,72.07 44.29,72.07 43.81,72.55 43.18,72.55 42.7,72.07 37.31,72.07 36.83,72.55 36.2,72.55 35.72,72.07 32.86,72.07 32.38,72.55 31.75,72.55 31.27,72.07 26.99,72.07 26.83,71.91 24.61,71.91 22.54,73.98 11.11,73.98 10.48,73.34 10.48,71.75 10.16,71.75 9.84,71.44 7.46,71.44 6.99,71.91 4.45,71.91 v3.97,72.39 | J17.9 v2.7,49.85
2A  (via drill 0.61)
  Top 0.254: Q2.3 v32.07,71.6
  Bottom 0.254: J10.4 17.78,72.71 18.1,72.39 18.1,71.44 27.15,71.44 27.3,71.6 v32.07,71.6
2B  (via drill 0.61)
  Top 0.254: v24.92,63.98 24.92,55.88 24.77,55.72 24.77,55.09 25.24,54.61 25.24,47.15 24.45,46.35 24.45,35.56 24.13,35.24 24.13,32.23 24.29,32.07 v24.29,29.05 | v67.63,29.05 67.63,35.56 67.31,35.88 67.31,41.43 67.94,42.07 v67.94,44.61 | v71.44,44.61 70.96,45.09 70.96,60.33 71.6,60.96 71.6,66.36 70.8,67.15 v70.8,77.95 | Q6.3 v54.93,77.95
  Bottom 0.254: J12.4 17.46,65.09 18.73,63.82 24.77,63.82 v24.92,63.98 | v67.63,29.05 v24.29,29.05 | v71.44,44.61 v67.94,44.61 | v54.93,77.95 v70.8,77.95
2C  (via drill 0.61)
  Top 0.254: J14.4 16.83,58.58 17.3,59.05 17.3,59.85 18.1,60.64 v18.1,63.18 | Q10.3 v32.07,63.02
  Bottom 0.254: v18.1,63.18 18.26,63.34 24.29,63.34 24.61,63.02 v32.07,63.02
2D  (via drill 0.61)
  Top 0.254: v59.85,47.31 59.85,48.9 59.37,49.37 59.37,68.42 v59.53,68.58
  Bottom 0.254: J16.4 17.78,49.85 18.1,49.53 18.1,48.58 20,48.58 20.32,48.9 20.95,48.9 21.27,48.58 28.26,48.58 29.53,49.85 41.43,49.85 42.7,48.58 46.83,48.58 48.1,47.31 v59.85,47.31 | v59.53,68.58 58.74,69.37 58.74,71.12 56.83,71.12 55.56,69.85 Q14.3
3A  (via drill 0.61)
  Top 0.254: J10.5 19.37,73.82 19.84,74.3 19.84,75.09 20.64,75.88 v20.64,77.79 | Q3.3 v37.78,77.95
  Bottom 0.254: v20.64,77.79 24.61,77.79 24.77,77.95 v37.78,77.95
3B  (via drill 0.61)
  Top 0.254: v2.06,63.82 2.06,63.34 1.27,62.55 1.27,28.89 2.06,28.1 v2.06,27.62 | v77.95,27.46 78.74,28.26 78.74,72.71 v77.95,73.5 | v71.75,76.99 v71.75,73.5
  Bottom 0.254: J12.5 18.26,65.09 18.1,65.25 18.1,66.36 11.11,66.36 10.48,65.72 10.48,64.14 10.16,64.14 9.84,63.82 v2.06,63.82 | v2.06,27.62 26.04,27.62 26.99,28.57 66.83,28.57 67.94,27.46 v77.95,27.46 | v71.75,73.5 v77.95,73.5 | v71.75,76.99 70.48,76.99 70.01,77.47 62.55,77.47 61.28,76.2 Q7.3
3C  (via drill 0.61)
  Top 0.254: v28.57,58.58 28.1,59.05 28.1,65.72 v28.57,66.2 | Q11.3 v37.78,66.2
  Bottom 0.254: J14.5 20.32,57.47 20.64,57.78 20.64,58.74 25.88,58.74 26.04,58.58 v28.57,58.58 | v37.78,66.2 v28.57,66.2
3D  (via drill 0.61)
  Top 0.254: v19.37,44.45 J16.5 | v46.83,38.58 v46.83,44.45 | v76.83,38.89 77.31,39.37 77.31,55.56 75.72,57.15 v75.72,62.07 | Q15.3 v60.64,71.6
  Bottom 0.254: v19.37,44.45 29.21,44.45 29.53,44.77 41.43,44.77 41.75,44.45 v46.83,44.45 | v46.83,38.58 47.31,39.05 60.96,39.05 61.44,38.58 62.07,38.58 62.39,38.89 v76.83,38.89 | v75.72,62.07 76.04,62.39 76.52,62.39 78.42,64.29 78.42,66.36 75.72,66.36 73.5,68.58 72.71,68.58 69.69,71.6 v60.64,71.6
4A  (via drill 0.61)
  Top 0.254: v36.2,76.99 36.51,76.68 v36.51,71.6 | Q4.3 v43.5,71.6
  Bottom 0.254: J9.6 23.65,76.52 24.45,77.31 24.92,77.31 25.08,77.47 35.72,77.47 v36.2,76.99 | v43.5,71.6 v36.51,71.6
4B  (via drill 0.61)
  Top 0.254: J11.6 21.91,70.01 22.38,70.48 v22.7,70.48 | v3.02,71.44 3.02,63.5 1.75,62.23 1.75,29.21 3.02,27.94 v3.02,25.72 | v76.83,22.38 76.83,30.64 77.79,31.59 77.79,55.88 76.2,57.47 76.2,61.28 76.68,61.75 76.68,62.87 v76.2,63.34 | v70.64,63.34 70.64,64.29 70.8,64.45 70.8,66.36 70.33,66.83 70.33,68.42 70.17,68.58 70.17,71.44 70.33,71.6 70.33,74.77 70.17,74.93 70.17,76.83 69.53,77.47 66.36,77.47 Q8.3
  Bottom 0.254: v22.7,70.48 22.23,70.96 13.34,70.96 13.18,71.12 12.54,71.12 12.38,70.96 7.14,70.96 6.67,71.44 v3.02,71.44 | v3.02,25.72 9.05,25.72 10,26.67 25.72,26.67 26.67,25.72 47.15,25.72 48.9,23.97 49.53,23.97 50.01,24.45 59.69,24.45 61.59,22.54 65.72,22.54 65.88,22.38 v76.83,22.38 | v70.64,63.34 v76.2,63.34
4C  (via drill 0.61)
  Top 0.254: v23.65,64.93 v23.65,61.28 | Q12.3 v43.5,64.77
  Bottom 0.254: v23.65,61.28 J13.6 | v23.65,64.93 31.11,64.93 31.59,64.45 40.01,64.45 40.32,64.77 v43.5,64.77
4D  (via drill 0.61)
  Top 0.254: v35.72,59.85 v35.72,54.93 | Q16.3 v66.36,63.82
  Bottom 0.254: J15.6 26.35,53.66 27.46,54.77 29.37,54.77 29.53,54.93 v35.72,54.93 | v35.72,59.85 36.99,59.85 37.15,60.01 60.01,60.01 62.55,62.55 65.09,62.55 v66.36,63.82
A  (via drill 0.61)
  Top 0.254: 12.46,63.1 11.75,63.82 J12.2 | 12.46,63.1 13.02,62.55 13.02,60.48 11.75,59.21 J14.2 11.75,56.2 13.02,54.93 13.02,52.39 11.75,51.12 J16.2 v11.75,47.62 | J10.2 11.75,71.44 12.22,70.96 12.22,70.8 v12.86,70.17 13.02,70.01 13.02,67.63 12.54,67.15 12.54,63.18 12.46,63.1 | v38.1,41.75 J8.15 | v7.94,41.75 R19.P$2 v7.94,47.62
  Bottom 0.254: v12.86,70.17 J17.1 | R19.P$2 R30.P$2 | v7.94,41.75 v38.1,41.75 | v7.94,47.62 v11.75,47.62
AA  (via drill 0.61)
  Top 0.254: J5.19 IC2.39 | v7.94,35.24 R19.P$1
  Bottom 0.254: v7.94,35.24 10.79,35.24 12.06,33.97 J5.19
AD0
  Top 0.254: IC2.1 J4.1 10.16,11.59 8.89,10.32 J20.3
AD1
  Top 0.254: IC2.2 J4.2 12.7,11.11 12.06,10.48 J21.3
AD2
  Top 0.254: IC2.3 J4.3 J22.3
AD3
  Top 0.254: IC2.4 J4.4 17.78,11.11 18.41,10.48 J23.3
AD4
  Top 0.254: IC2.5 J4.5 20.32,11.59 21.59,10.32 J24.3
AD5
  Top 0.254: IC2.6 J4.6 22.86,11.75 24.77,9.84 J25.3
AD6  (via drill 0.61)
  Top 0.254: IC2.7 J4.7 25.4,11.11 25.88,10.64 v25.88,10.48
  Bottom 0.254: J26.3 27.15,9.21 v25.88,10.48
AD7  (via drill 0.61)
  Top 0.254: J4.8 IC2.8 | J27.3 31.11,10.64 v31.43,10.95
  Bottom 0.254: v31.43,10.95 31.27,11.11 29.84,11.11 28.57,12.38 J4.8
B  (via drill 0.61)
  Top 0.254: v10.48,42.7 R20.P$2 | v21.75,42.7 21.75,44.29 21.91,44.45 J16.6 21.91,51.75 23.18,53.02 23.18,54.29 21.91,55.56 J14.6 21.91,59.37 20.64,60.64 20.64,62.55 21.91,63.82 J12.6 v21.91,66.83 21.91,66.99 20.64,68.26 20.64,69.53 21.75,70.64 21.75,70.8 21.91,70.96 J10.6
  Bottom 0.254: v10.48,42.7 10.95,42.23 21.27,42.23 v21.75,42.7 | J17.2 7.14,67.63 7.62,67.15 14.92,67.15 15.24,66.83 v21.91,66.83
B0  (via drill 0.61)
  Top 0.254: IC2.12 J4.12 38.1,11.11 38.42,10.79 v38.42,10.48
  Bottom 0.254: J7.2 41.59,9.21 40.32,10.48 v38.42,10.48
B1  (via drill 0.61)
  Top 0.254: IC2.13 J4.13 40.64,11.43 v41.59,10.48
  Bottom 0.254: J18.2 44.77,9.21 43.5,10.48 v41.59,10.48
B2  (via drill 0.61)
  Top 0.254: J4.14 IC2.14 | J19.2 49.85,10.79 v49.53,11.11
  Bottom 0.254: v49.53,11.11 45.09,11.11 43.81,12.38 J4.14
BB  (via drill 0.61)
  Top 0.254: IC2.38 J5.18 v15.24,36.2 | R20.P$1 10.48,37.31 11.43,36.35 v11.43,36.2
  Bottom 0.254: v15.24,36.2 v11.43,36.2
BUZZ  (via drill 0.61)
  Top 0.254: J5.11 IC2.31 | J2.2 29.84,35.72 v29.53,35.4
  Bottom 0.254: v29.53,35.4 29.69,35.24 31.11,35.24 32.38,33.97 J5.11
C  (via drill 0.61)
  Top 0.254: v16.51,47.15 15.72,47.94 15.72,48.42 15.56,48.58 15.56,51.12 16.11,51.67 | 16.11,51.67 16.83,52.39 J15.4 | J17.3 5.4,66.04 5.71,66.36 6.19,66.36 6.19,66.52 6.67,66.99 6.67,68.42 v6.83,68.58 | 16.11,67.55 16.83,68.26 J11.4 | 16.11,67.55 15.56,66.99 15.56,63.98 16.83,62.71 J13.4 16.83,59.37 15.56,58.1 15.56,56.2 15.72,56.04 15.72,55.72 16.03,55.4 16.03,51.75 16.11,51.67 | J9.4 16.83,74.61 15.56,73.34 15.56,70.96 16.03,70.48 16.03,67.63 16.11,67.55
  Bottom 0.254: R22.P$2 13.97,45.72 14.29,46.04 14.29,46.99 16.35,46.99 v16.51,47.15 | v6.83,68.58 7.3,68.1 7.46,68.1 7.94,67.63 14.92,67.63 16.19,68.9 J11.4
CC  (via drill 0.61)
  Top 0.254: J5.17 IC2.37 | R22.P$1 13.02,36.04 v13.81,35.24
  Bottom 0.254: v13.81,35.24 15.88,35.24 17.14,33.97 J5.17
CLK  (via drill 0.61)
  Top 0.254: IC2.29 J5.9 38.1,35.24 39.37,36.51 v39.37,40.48 | v45.88,40.48 45.88,46.35 46.35,46.83 46.35,55.72 v45.88,56.2
  Bottom 0.254: U1.14 68.1,56.2 66.83,54.93 53.18,54.93 52.86,55.24 51.91,55.24 50.96,56.2 U2.14 v45.88,56.2 | v45.88,40.48 v39.37,40.48
D  (via drill 0.61)
  Top 0.254: J15.2 11.75,55.4 10.48,56.67 10.48,58.74 11.75,60.01 J13.2 | v10.48,62.39 10.48,65.72 11.75,66.99 J11.2 11.75,70.64 10.48,71.91 10.48,73.34 11.75,74.61 J9.2 | R23.P$2 15.56,46.35 14.92,46.99 13.81,46.99 13.81,47.31 13.18,47.94 13.18,48.42 v13.02,48.58 | v6.67,48.58 6.67,60.64 5.4,61.91 J17.4
  Bottom 0.254: J17.4 9.84,62.55 10.08,62.31 | 10.08,62.31 11.11,61.28 J13.2 | v10.48,62.39 10.16,62.39 10.08,62.31 | v6.67,48.58 v13.02,48.58
D0
  Top 0.254: IC2.21 J5.1 J8.7
D1
  Top 0.254: IC2.22 J5.2 J8.8
D2
  Top 0.254: IC2.23 J5.3 J8.9
D3
  Top 0.254: IC2.24 J5.4 J8.10
D4
  Top 0.254: IC2.25 J5.5 J8.11
D5
  Top 0.254: IC2.26 J5.6 J8.12
D6
  Top 0.254: IC2.27 J5.7 J8.13
D7
  Top 0.254: IC2.28 J5.8 J8.14
DD  (via drill 0.61)
  Top 0.254: IC2.36 J5.16 v20.32,36.2 | R23.P$1 15.56,37.15 v16.51,36.2
  Bottom 0.254: v20.32,36.2 v16.51,36.2
DP  (via drill 0.61)
  Top 0.254: v25.72,55.4 R27.P$2 | J15.3 14.29,55.09 v13.49,55.88 13.49,55.72 13.34,55.72 13.02,56.04 13.02,58.74 13.57,59.29 | J13.3 14.29,60.01 13.57,59.29 | 13.57,59.29 13.49,59.37 13.49,62.87 13.02,63.34 13.02,66.04 14.29,67.31 J11.3 14.29,70.64 13.02,71.91 13.02,73.34 14.29,74.61 J9.3
  Bottom 0.254: J17.8 12.38,52.39 13.65,53.66 J15.3 | v25.72,55.4 13.97,55.4 v13.49,55.88
DPP  (via drill 0.61)
  Top 0.254: IC2.32 J5.12 30.48,35.24 31.11,35.88 v31.11,38.42
  Bottom 0.254: R27.P$1 28.89,38.1 29.21,38.42 v31.11,38.42
E  (via drill 0.61)
  Top 0.254: J9.1 9.21,74.61 7.94,73.34 7.94,71.91 9.21,70.64 J11.1 9.21,66.99 7.94,65.72 7.94,64.29 9.21,63.02 J13.1 9.21,59.37 7.94,58.1 7.94,56.67 9.21,55.4 J15.1 9.21,52.39 10.48,51.12 10.48,48.58 10.64,48.42 10.64,47.47 11.75,46.35 v11.75,44.29 | v18.1,43.97 R24.P$2
  Bottom 0.254: J17.5 6.67,60.01 7.94,61.28 J13.1 | v18.1,43.97 12.06,43.97 v11.75,44.29
EE  (via drill 0.61)
  Top 0.254: J5.15 IC2.35 | R24.P$1 18.1,36.04 v18.89,35.24
  Bottom 0.254: v18.89,35.24 20.95,35.24 22.23,33.97 J5.15
EN  (via drill 0.61)
  Top 0.254: J4.15 IC2.15 v45.72,18.41 | J8.6 60.96,25.72 61.44,25.24 61.44,21.43 59.69,19.68 v59.69,18.41
  Bottom 0.254: v59.69,18.41 59.21,18.89 57.78,18.89 57.47,19.21 46.51,19.21 v45.72,18.41
F  (via drill 0.61)
  Top 0.254: v14.29,48.1 J16.3 14.29,51.28 15.56,52.55 15.56,55.09 14.29,56.36 J14.3 14.29,59.21 15.56,60.48 15.56,62.55 15.08,63.02 15.08,67.15 15,67.23 | R25.P$2 v20.64,47.94 | J12.3 14.29,66.52 15,67.23 | 15,67.23 15.56,67.79 15.56,70.17 14.29,71.44 J10.3
  Bottom 0.254: v14.29,48.1 20.48,48.1 v20.64,47.94 | J17.6 7.3,57.47 8.57,58.74 12.38,58.74 13.65,57.47 J14.3
FF  (via drill 0.61)
  Top 0.254: IC2.34 J5.14 v25.4,35.88 | R25.P$1 20.64,37.15 21.59,36.2 v21.59,35.88
  Bottom 0.254: v25.4,35.88 v21.59,35.88
G  (via drill 0.61)
  Top 0.254: J9.5 19.37,74.61 18.1,73.34 18.1,71.44 19.37,70.17 J11.5 19.37,67.63 18.1,66.36 18.1,64.45 19.37,63.18 J13.5 19.37,59.37 18.1,58.1 18.1,56.2 19.37,54.93 J15.5 v19.37,51.75 | v23.18,51.75 R26.P$2
  Bottom 0.254: J17.7 17.46,54.93 18.73,53.66 J15.5 | v19.37,51.75 v23.18,51.75
GG  (via drill 0.61)
  Top 0.254: IC2.33 J5.13 v27.94,36.83
  Bottom 0.254: R26.P$1 24.13,38.1 24.45,37.78 24.45,36.83 v27.94,36.83
GND  (via drill 0.61)
  Top 0.508: 40.32,73.03 40.32,73.5 40.48,73.66 40.48,74.93 40.32,75.09 Q3.1 | 40.32,73.03 Q11.1 | Q9.1 28.89,73.5 29.05,73.66 29.05,74.93 28.89,75.09 Q1.1 30.64,77.95 34.61,77.95 Q2.1 34.61,75.09 34.77,74.93 34.77,73.66 34.61,73.5 v34.61,73.18 Q10.1 | v40.16,73.03 40.32,73.03 | Q12.1 46.04,73.5 46.2,73.66 46.2,74.93 46.04,75.09 Q4.1 | 51.75,72.71 51.75,73.5 51.91,73.66 51.91,74.93 51.75,75.09 Q5.1 | 51.75,72.71 Q13.1 | v57.94,63.82 57.94,68.26 57.47,68.74 Q14.1 57.47,72.71 | Q6.1 57.47,75.09 57.63,74.93 57.63,73.66 57.47,73.5 57.47,72.71 | v51.91,72.71 51.75,72.71 | v57.31,72.71 57.47,72.71 | v40.96,39.05 40.96,41.59 | 40.96,41.59 U2.8 | J8.16 v35.56,39.05 | 63.18,73.03 63.18,73.5 63.34,73.66 63.34,74.93 63.18,75.09 Q7.1 | 63.18,73.03 63.18,72.55 | 63.18,72.55 Q15.1 | v69.53,43.5 R31.P$1 69.53,68.1 68.9,68.74 Q16.1 68.9,73.03 | Q17.1 74.61,70.64 75.09,70.17 v75.09,65.09 | Q8.1 68.9,75.09 69.06,74.93 69.06,73.66 68.9,73.5 68.9,73.03 | v63.34,73.03 63.18,73.03 | v68.74,73.03 68.9,73.03 | U1.8 v66.36,41.75 | v41.12,41.59 40.96,41.59 | v60.01,73.34 60.8,73.34 61.59,72.55 63.18,72.55 | R29.E 72.71,35.24 73.66,36.2 J8.1 v73.66,41.75 | C1.2 65.41,29.05 66.36,30 D1.K v66.36,33.97 | C3.2 v71.75,15.88 | C2.2 66.67,17.78 v66.67,16.03 67.63,15.08 J1.1 | v58.42,20.32 IC2.20 J4.20 v58.42,7.3 | v34.61,6.67 J6.1
  Bottom 0.508: v40.16,73.03 39.85,73.03 39.69,72.87 38.42,72.87 38.26,73.03 37.47,73.03 37.31,73.18 v34.61,73.18 | Q12.1 47.15,69.85 48.58,71.28 49.85,71.28 51.28,69.85 Q13.1 | v57.94,63.82 R21.P$1 | v51.91,72.71 52.23,72.39 56.99,72.39 v57.31,72.71 57.47,72.87 59.69,72.87 60.01,73.18 v60.01,73.34 | Q3.1 41.43,76.2 42.86,77.63 44.13,77.63 45.56,76.2 Q4.1 | v35.56,39.05 v40.96,39.05 | J8.16 J2.1 | v69.53,43.5 U1.8 | R31.P$1 v75.09,65.09 | v63.34,73.03 63.66,72.71 68.1,72.71 68.42,73.03 v68.74,73.03 | v41.12,41.59 66.2,41.59 v66.36,41.75 v73.66,41.75 | v66.36,33.97 R29.E | IC1.2 v71.75,15.88 71.6,16.03 v66.67,16.03 66.2,15.56 IC2.20 | C3.2 70.48,25.72 69.37,26.83 67.63,26.83 67.47,26.99 65.41,26.99 C1.2 | R2.P$1 44.29,20.95 44.93,20.32 v58.42,20.32 | v58.42,7.3 C8.1 C6.1 51.75,7.3 51.12,6.67 J19.1 J18.1 J7.1 v34.61,6.67 J27.2 J26.2 J25.2 J24.2 J23.2 J22.2 J21.2 J20.2 v7.14,6.67
N$2  (via drill 0.61)
  Top 0.508: J1.2 70.17,9.84 71.12,10.79 71.12,14.29 69.83,15.58 69.85,17.14 69.85,17.62 v70.64,18.41 70.64,19.21 68.58,21.27 66.99,21.27 65.41,22.86 C1.1
  Bottom 0.508: v70.64,18.41 IC1.1
N$3  (via drill 0.61)
  Top 0.254: v76.36,43.5 76.83,43.97 76.83,53.18 v76.36,53.66 | C4.1 52.39,53.02 53.66,51.75 v53.66,40.48 | v72.23,43.5 v72.23,40.64
  Bottom 0.254: v76.36,43.5 U1.9 v72.23,43.5 | U1.13 v76.36,53.66 | v53.66,40.48 54.13,40.96 65.88,40.96 66.04,40.8 66.67,40.8 66.99,41.12 71.75,41.12 v72.23,40.64
N$4  (via drill 0.61)
  Top 0.254: U2.11 48.58,49.37 47.31,50.64 47.31,51.59 48.58,52.86 U2.13 | v53.98,52.86 v53.98,58.74
  Bottom 0.254: v53.98,58.74 C5.1 | v53.98,52.86 53.02,52.86 52.86,52.7 51.91,52.7 51.59,53.02 50.96,53.02 50.32,53.66 U2.13
N$5  (via drill 0.61)
  Top 0.254: R31.P$2 v77.15,58.74 | C5.2 52.39,62.07 51.91,62.55 v51.91,65.41 | v67.47,65.41 67.47,61.91 67.94,61.44 v67.94,58.74
  Bottom 0.254: v77.15,58.74 U1.15 v67.94,58.74 | v51.91,65.41 51.91,65.88 66.99,65.88 v67.47,65.41
N$6  (via drill 0.61)
  Top 0.254: v50.32,57.15 v50.32,58.74 | v62.07,57.63 v62.07,63.82
  Bottom 0.254: v50.32,58.74 U2.15 | v50.32,57.15 50.8,56.67 51.28,56.67 51.44,56.52 C4.2 53.98,56.52 54.93,57.47 57.47,57.47 57.63,57.63 v62.07,57.63 | v62.07,63.82 R21.P$2
N$12  (via drill 0.61)
  Top 0.254: U1.3 66.36,55.4 65.41,54.45 64.77,54.45 | 64.77,54.45 63.82,54.45 R33.P$1 | v32.38,27.15 R28.P$1 | v59.53,27.15 60.01,27.62 60.01,32.23 v59.53,32.7 | v62.07,33.02 62.07,35.72 62.23,35.88 62.23,38.73 62.71,39.21 62.71,42.39 62.55,42.55 62.55,49.21 63.18,49.85 64.77,49.85 64.77,50.16 65.09,50.48 65.09,51.75 64.77,52.07 64.77,54.45
  Bottom 0.254: v32.38,27.15 32.86,26.67 48.58,26.67 49.53,27.62 59.05,27.62 v59.53,27.15 | v59.53,32.7 61.75,32.7 v62.07,33.02
N$13
  Bottom 0.254: U1.2 65.72,58.74 65.56,58.58 65.56,57.15 64.61,56.2 R3.P$1
N$14
  Bottom 0.254: U1.4 65.72,53.66 65.56,53.5 65.56,52.07 64.61,51.12 R4.P$1
N$15
  Top 0.254: U1.7 66.36,45.24 65.41,44.29 63.82,44.29 R5.P$1
N$16  (via drill 0.61)
  Top 0.254: v68.42,46.04 68.9,46.51 68.9,62.39 v68.42,62.87
  Bottom 0.254: v68.42,46.04 U1.10 | v68.42,62.87 66.2,62.87 64.61,61.28 R6.P$1
N$17
  Bottom 0.254: U1.1 65.41,61.28 65.09,60.96 65.09,60.01 64.61,59.53 64.61,58.74 R7.P$1
N$18
  Top 0.254: U1.5 66.36,50.32 65.41,49.37 63.82,49.37 R8.P$1
N$19
  Top 0.254: U1.6 66.36,47.78 65.41,46.83 63.82,46.83 R9.P$1
N$20
  Bottom 0.254: U2.3 40.01,56.2 39.69,55.88 39.69,54.93 39.21,54.45 39.21,53.66 R10.P$1
N$21
  Top 0.254: U2.2 40.96,57.94 40.01,56.99 38.42,56.99 R11.P$1
N$22
  Bottom 0.254: U2.4 40.32,53.66 40.16,53.5 40.16,52.07 39.21,51.12 R12.P$1
N$23  (via drill 0.61)
  Top 0.254: v61.91,31.75 R1.P$1
  Bottom 0.254: D1.A v61.91,31.75
N$24
  Top 0.254: U2.7 40.96,45.24 40.01,44.29 38.42,44.29 R13.P$1
N$25  (via drill 0.61)
  Top 0.254: v46.83,63.02 v46.83,46.04 | R14.P$1 v38.42,63.02
  Bottom 0.254: v46.83,46.04 U2.10 | v38.42,63.02 v46.83,63.02
N$26
  Top 0.254: U2.1 40.96,60.48 40.01,59.53 38.42,59.53 R15.P$1
N$27
  Top 0.254: U2.5 40.96,50.32 40.01,49.37 38.42,49.37 R16.P$1
N$28
  Top 0.254: U2.6 40.96,47.78 40.01,46.83 38.42,46.83 R17.P$1
N$29
  Bottom 0.254: R18.P$1 U2.9
RS  (via drill 0.61)
  Top 0.254: J4.17 IC2.17 v50.8,25.88 | J8.4 66.04,34.92 65.25,34.13 65.25,33.18 65.09,33.02 65.09,29.69 63.82,28.42 v63.82,25.88
  Bottom 0.254: v63.82,25.88 60.17,25.88 59.69,25.4 51.28,25.4 v50.8,25.88
RST  (via drill 0.61)
  Top 0.254: J4.9 IC2.9 v30.48,19.05 | C7.2 61.28,11.43 60.64,12.06 v60.64,19.37 | R2.P$2 v34.92,19.05
  Bottom 0.254: v60.64,19.37 58.1,19.37 57.78,19.68 37.94,19.68 36.67,20.95 R2.P$2 | v34.92,19.05 v30.48,19.05
RW  (via drill 0.61)
  Top 0.254: J4.16 IC2.16 48.26,16.83 49.21,17.78 v49.21,24.92 | v63.5,35.4 J8.5 | v60.01,35.4 60.48,34.92 v60.48,24.92
  Bottom 0.254: v60.01,35.4 v63.5,35.4 | v49.21,24.92 v60.48,24.92
RXD  (via drill 0.61)
  Top 0.254: IC2.10 J4.10 33.02,10.95 32.86,10.79 v32.86,10.48
  Bottom 0.254: J6.2 36.2,9.21 35.88,9.53 35.88,10.48 v32.86,10.48
SYNC  (via drill 0.61)
  Top 0.254: J5.10 IC2.30 v35.56,24.77 | v24.77,25.24 R28.P$2
  Bottom 0.254: v24.77,25.24 35.08,25.24 v35.56,24.77
T0  (via drill 0.61)
  Top 0.254: v25.08,74.3 25.08,68.9 25.88,68.1 25.88,60.33 25.4,59.85 25.4,56.99 26.67,55.72 v26.67,52.55 | v50.64,54.61 50.64,49.37 v51.12,48.9 | v55.09,49.85 55.09,50.32 54.93,50.48 54.93,51.75 56.2,53.02 R33.P$2
  Bottom 0.254: v25.08,74.3 Q1.2 | v26.67,52.55 29.37,52.55 29.53,52.39 39.05,52.39 39.69,53.02 39.69,54.13 40.48,54.93 49.05,54.93 49.37,54.61 v50.64,54.61 | v51.12,48.9 51.59,49.37 54.45,49.37 54.93,49.85 v55.09,49.85
T1  (via drill 0.61)
  Top 0.254: v30.8,67.15 v30.8,74.3 | v34.92,67.15 33.81,66.04 33.81,56.99 34.29,56.52 v34.29,35.88 | v54.61,35.88 54.61,40.8 54.13,41.27 54.13,51.75 54.93,52.55 54.93,54.29 56.2,55.56 R3.P$2
  Bottom 0.254: v30.8,74.3 Q2.2 | v30.8,67.15 31.27,66.67 34.45,66.67 v34.92,67.15 | v54.61,35.88 v34.29,35.88
T2  (via drill 0.61)
  Top 0.254: v44.93,50.16 44.93,56.52 45.88,57.47 v45.88,66.2 | v41.59,74.3 v41.59,66.2
  Bottom 0.254: R4.P$2 55.09,51.12 54.61,50.64 53.82,50.64 53.02,49.85 48.1,49.85 47.78,50.16 v44.93,50.16 | v41.59,66.2 v45.88,66.2 | Q3.2 v41.59,74.3
T3  (via drill 0.61)
  Top 0.254: v57.94,43.18 57.94,48.9 58.42,49.37 58.42,61.91 v57.94,62.39 | v49.69,63.02 49.53,63.18 49.53,66.99 47.94,68.58 v47.94,74.3
  Bottom 0.254: v57.94,43.18 R5.P$2 | v57.94,62.39 57.63,62.39 57.47,62.55 55.56,62.55 54.13,63.98 51.75,63.98 50.8,63.02 v49.69,63.02 | Q4.2 v47.94,74.3
T4  (via drill 0.61)
  Top 0.254: v52.86,62.87 53.18,63.18 53.18,68.42 53.02,68.58 v53.02,74.3
  Bottom 0.254: R6.P$2 54.45,61.28 v52.86,62.87 | Q5.2 v53.02,74.3
T5  (via drill 0.61)
  Top 0.254: R7.P$2 56.2,59.37 56.04,59.53 54.45,59.53 54.45,62.55 53.66,63.34 53.66,73.66 v54.29,74.3
  Bottom 0.254: Q6.2 v54.29,74.3
T6  (via drill 0.61)
  Top 0.254: v58.9,48.58 58.9,67.94 58.58,68.26 58.58,69.06 58.74,69.22 v58.74,74.3
  Bottom 0.254: v58.9,48.58 R8.P$2 | Q7.2 v58.74,74.3
T7  (via drill 0.61)
  Top 0.254: v60.8,46.04 60.8,52.7 59.85,53.66 59.85,64.45 v60.33,64.93 | v65.09,74.3 v65.09,64.93
  Bottom 0.254: v60.8,46.04 R9.P$2 | v60.33,64.93 63.02,64.93 63.18,65.09 64.93,65.09 v65.09,64.93 | Q8.2 v65.09,74.3
T8  (via drill 0.61)
  Top 0.254: Q9.2 v27.62,53.66
  Bottom 0.254: v27.62,53.66 R10.P$2
T9  (via drill 0.61)
  Top 0.254: Q10.2 v33.34,56.2
  Bottom 0.254: v33.34,56.2 R11.P$2
T10  (via drill 0.61)
  Top 0.254: v36.67,67.94 v36.67,51.12
  Bottom 0.254: v36.67,51.12 R12.P$2 | Q11.2 v36.67,67.94
T11  (via drill 0.61)
  Top 0.254: v32.54,47.15 v32.54,43.5 | v42.55,67.94 v42.55,47.62
  Bottom 0.254: v32.54,43.5 R13.P$2 | v32.54,47.15 36.99,47.15 37.15,47.31 41.43,47.31 41.75,47.62 v42.55,47.62 | Q12.2 v42.55,67.94
T12  (via drill 0.61)
  Top 0.254: v30.8,63.98 R14.P$2 | Q13.2 v50.48,63.98
  Bottom 0.254: v30.8,63.98 40.01,63.98 40.48,63.5 46.04,63.5 46.51,63.98 v50.48,63.98
T13  (via drill 0.61)
  Top 0.254: v44.93,57.78 45.4,57.78 45.4,63.98 v44.93,64.45 | v54.93,64.93 56.2,66.2 Q14.2
  Bottom 0.254: R15.P$2 35.88,58.74 37.15,57.47 41.43,57.47 41.75,57.78 v44.93,57.78 | v44.93,64.45 49.69,64.45 50.16,64.93 50.96,64.93 51.44,64.45 54.45,64.45 v54.93,64.93
T14  (via drill 0.61)
  Top 0.254: v33.34,48.58 33.81,48.1 33.81,38.58 33.66,38.42 33.66,36.51 33.34,36.2 33.34,35.56 34.29,34.61 v34.29,32.7 | v44.45,39.53 v44.45,32.7 | v61.75,39.53 61.75,46.35 61.28,46.83 61.28,53.02 60.33,53.98 60.33,63.66 61.91,65.25 Q15.2
  Bottom 0.254: v33.34,48.58 R16.P$2 | v44.45,32.7 v34.29,32.7 | v61.75,39.53 v44.45,39.53
T15  (via drill 0.61)
  Top 0.254: v36.2,46.04 36.2,39.69 36.67,39.21 36.67,38.58 36.83,38.42 36.83,32.23 36.99,32.07 v36.99,27.62 | v62.87,30 v62.87,27.62 | v77.79,30.32 77.79,30.8 78.26,31.27 78.26,56.67 v77.79,57.15 | v72.07,67.94 v72.07,57.78
  Bottom 0.254: v36.2,46.04 R17.P$2 | v36.99,27.62 37.47,28.1 62.39,28.1 v62.87,27.62 | v62.87,30 71.28,30 71.6,30.32 v77.79,30.32 | v77.79,57.15 74.77,57.15 74.45,57.47 73.5,57.47 73.18,57.78 v72.07,57.78 | Q16.2 v72.07,67.94
T16  (via drill 0.61)
  Top 0.254: v62.23,52.39 62.07,52.55 v62.07,56.36 | v73.03,60.01 73.03,60.48 72.55,60.96 72.55,67.15 73.34,67.94 Q17.2
  Bottom 0.254: R18.P$2 54.29,51.12 55.56,52.39 v62.23,52.39 | v62.07,56.36 63.18,57.47 64.45,57.47 65.09,58.1 65.09,59.21 65.88,60.01 v73.03,60.01
TXD  (via drill 0.61)
  Top 0.254: J4.11 IC2.11 | J6.3 39.69,10.79 39.37,11.11 v39.37,13.65
  Bottom 0.254: v39.37,13.65 37.47,13.65 36.2,12.38 J4.11
VCC  (via drill 0.61)
  Top 0.508: v10.16,28.73 IC2.40 J5.20 v10.16,36.35 | v5.4,36.35 R30.P$1 | v7.14,4.13 6.03,5.24 6.03,8.57 6.35,8.89 6.35,26.19 5.4,27.15 v5.4,28.89 | 64.14,12.7 64.14,17.78 C2.1 | 64.14,12.7 v64.14,7.3 | v64.29,12.7 64.14,12.7 | v74.3,28.89 C3.1 74.3,24.45 72.55,22.7 72.55,16.51 72.87,16.19 72.87,13.81 v72.55,13.49 | R29.A 72.71,30.64 71.12,32.23 J8.2 71.12,43.34 70.33,44.13 70.33,60.96 v70.64,61.28 | v48.58,66.52 U2.16 | U1.16 v73.98,66.83 | C7.1 v61.28,4.13
  Bottom 0.508: v10.16,36.35 v5.4,36.35 | v7.14,4.13 J20.1 J21.1 J22.1 J23.1 J24.1 J25.1 J26.1 J27.1 v61.28,4.13 | 72.55,13.34 71.91,13.34 71.28,12.7 R1.P$2 v64.29,12.7 | 72.55,13.34 IC1.3 | v64.14,7.3 61.28,7.3 C7.1 | v74.3,28.89 R29.A | v48.58,66.52 48.9,66.2 51.28,66.2 51.59,66.52 68.26,66.52 68.58,66.83 v73.98,66.83 | U1.16 v70.64,61.28 | v72.55,13.49 72.55,13.34 | v5.4,28.89 10,28.89 v10.16,28.73
VO  (via drill 0.61)
  Top 0.254: J8.3 v68.58,31.43
  Bottom 0.254: v68.58,31.43 R29.S
XTAL1  (via drill 0.61)
  Top 0.254: v52.55,17.62 52.55,21.59 Y1.2 | v55.88,17.62 IC2.19 J4.19 55.88,11.43 56.2,11.11 C8.2
  Bottom 0.254: v55.88,17.62 v52.55,17.62
XTAL2  (via drill 0.61)
  Top 0.254: IC2.18 J4.18 C6.2 | v47.78,17.62 47.78,21.59 Y1.1
  Bottom 0.254: v47.78,17.62 48.1,17.3 51.12,17.3 52.23,16.19 52.23,15.56 IC2.18
(copper drawn outside any net)
  shapes: Bottom circle x4, Top circle x4

### Text on the board
tNames: STC12C5A16AD | 7V-12V | GND | RXD | TXD | - | + | BOLAN XU 2022 MARS LANDER
Measures: BOLAN XU 2022 MARS LANDER